# Altium project Multiplier_AD835.PrjPCB
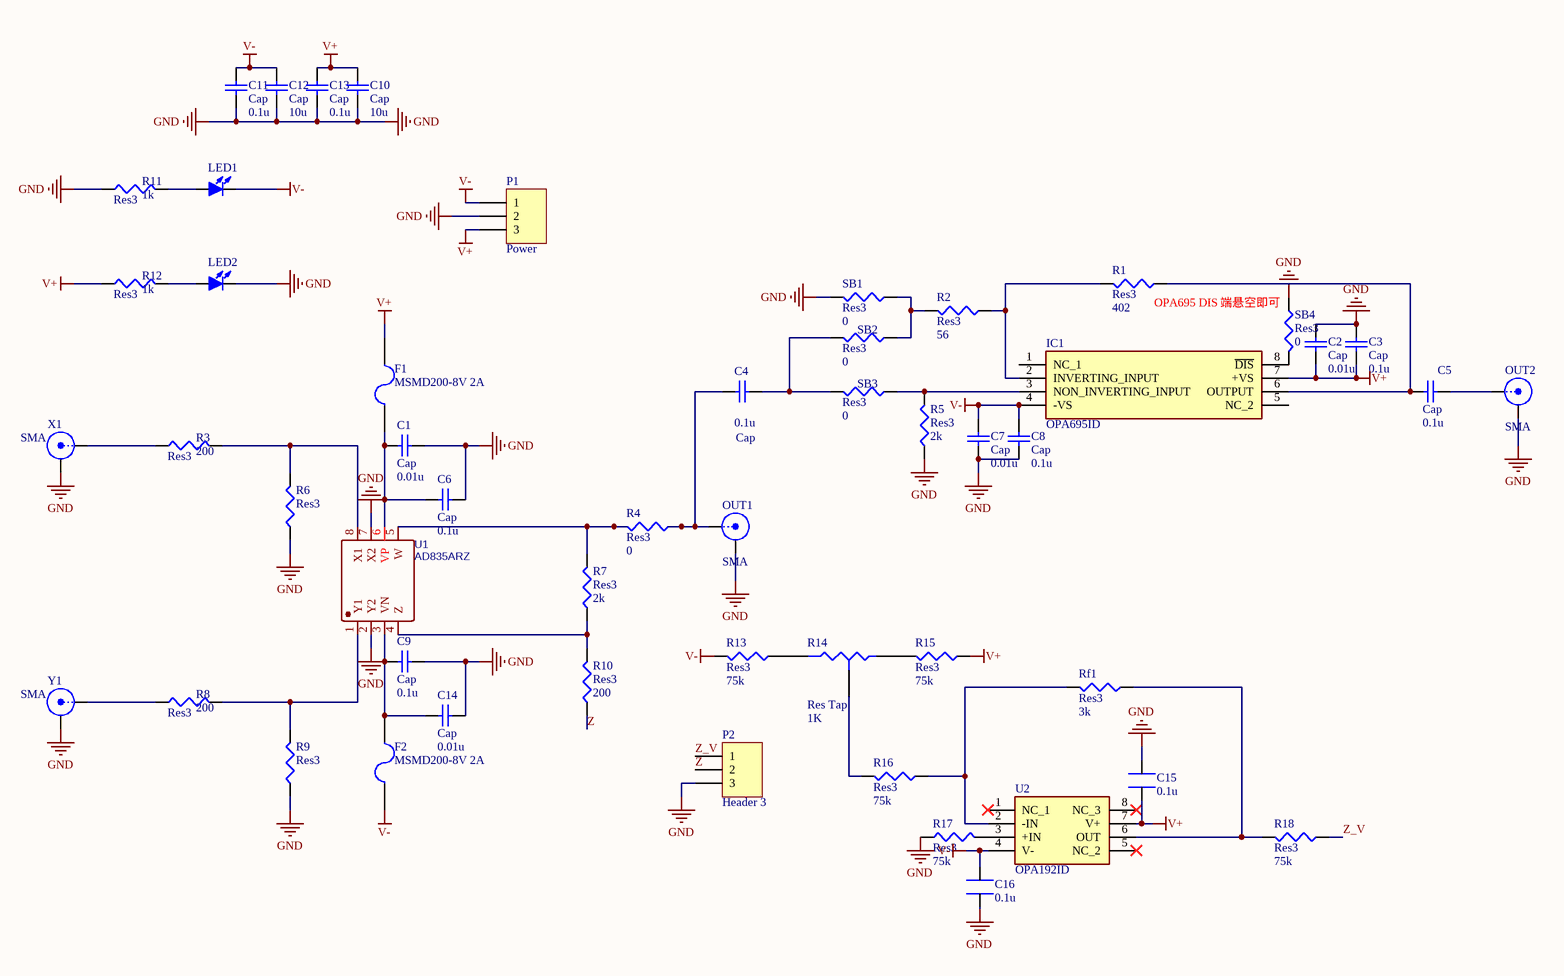
[diagram p0: Multiplier_AD835.SchDoc]
1 sheet, 52 parts. Net scope: global (net labels, ports and power ports of the same name join across sheets).
Board file: Multiplier_AD835.PcbDoc

## Sheet Multiplier_AD835.SchDoc
size A2; Organization: Altium Limited; Address1: L3, 12a Rodborough Rd; Address2: Frenchs Forest; Address3: NSW; Address4: Australia 2086

### Parts
C1  Cap  value 0.01u  [0805D]
C2  Cap  value 0.01u  [0805D]
C3  Cap  value 0.1u  [0805D]
C4  Cap  value 0.1u  [0805D]
C5  Cap  value 0.1u  [0805D]
C6  Cap  value 0.1u  [0805D]
C7  Cap  value 0.01u  [0805D]
C8  Cap  value 0.1u  [0805D]
C9  Cap  value 0.1u  [0805D]
C10  Cap  value 10u  [0805D]
C11  Cap  value 0.1u  [0805D]
C12  Cap  value 10u  [0805D]
C13  Cap  value 0.1u  [0805D]
C14  Cap  value 0.01u  [0805D]
C15  0.1u  [0805D]
C16  0.1u  [0805D]
F1  MSMD200-8V 2A  [0805D]
F2  MSMD200-8V 2A  [0805D]
IC1  OPA695ID  [SOIC127P600X175-8N]
LED1  (no value)  [0805D]
LED2  (no value)  [0805D]
OUT1  SMA  [SMA1]
OUT2  SMA  [SMA1]
P1  Power  [HDR1X3]
P2  Header 3  [HDR1X3]
R1  Res3  value 402  [0805D]
R2  Res3  value 56  [0805D]
R3  Res3  value 200  [0805D]
R4  Res3  value 0  [0805D]
R5  Res3  value 2k  [0805D]
R6  Res3  [0805D]
R7  Res3  value 2k  [0805D]
R8  Res3  value 200  [0805D]
R9  Res3  [0805D]
R10  Res3  value 200  [0805D]
R11  Res3  value 1k  [0805D]
R12  Res3  value 1k  [0805D]
R13  Res3  value 75k  [0805D]
R14  Res Tap  value 1K
R15  Res3  value 75k  [0805D]
R16  Res3  value 75k  [0805D]
R17  Res3  value 75k  [0805D]
R18  Res3  value 75k  [0805D]
Rf1  Res3  value 3k  [0805D]
SB1  Res3  value 0  [0805D]
SB2  Res3  value 0  [0805D]
SB3  Res3  value 0  [0805D]
SB4  Res3  value 0  [0805D]
U1  AD835ARZ  [AD835arz]
U2  OPA192ID  [SOIC127P600X175-8N]
X1  SMA  [SMA1]
Y1  SMA  [SMA1]

### Nets
GND: C1.1 C2.1 C3.2 C6.2 C7.2 C8.1 C9.1 C10.1 C11.1 C12.1 C13.1 C14.2 C15.1(SD) C16.1(SD) LED2.2(K) OUT1.2(Y) OUT2.2(Y) P1.2 P2.3 R5.1 R6.1 R9.1 R11.1 R17.2 SB1.2 SB4.1 U1.2(Y2) U1.7(X2) X1.2(Y) Y1.2(Y)
V+: C2.2 C3.1 C10.2 C13.2 C15.2(SD) F1.2 IC1.7(+VS) P1.3 R12.1 R15.1 U2.7(V+)
V-: C7.1 C8.2 C11.2 C12.2 C16.2(SD) F2.1 IC1.4(-VS) LED1.2(K) P1.1 R13.2 U2.4(V-)
Z: P2.2 R10.1
Z_V: P2.1 R18.1
NetC1_2: C1.2 C6.1 F1.1 U1.6(VP)
NetC4_1: C4.1 OUT1.1(X) R4.1
NetC4_2: C4.2 SB2.2 SB3.2
NetC5_1: C5.1 IC1.6(OUTPUT) R1.1
NetC5_2: C5.2 OUT2.1(X)
NetC9_2: C9.2 C14.1 F2.2 U1.3(VN)
NetIC1_2: IC1.2(INVERTING_INPUT) R1.2 R2.1
NetIC1_3: IC1.3(NON_INVERTING_INPUT) R5.2 SB3.1
NetIC1_8: IC1.8(~{DIS}) SB4.2
NetLED1_1: LED1.1(A) R11.2
NetLED2_1: LED2.1(A) R12.2
NetR2_2: R2.2 SB1.1 SB2.1
NetR3_1: R3.1 X1.1(X)
NetR3_2: R3.2 R6.2 U1.8(X1)
NetR4_2: R4.2 R7.2 U1.5(W)
NetR7_1: R7.1 R10.2 U1.4(Z)
NetR8_1: R8.1 Y1.1(X)
NetR8_2: R8.2 R9.2 U1.1(Y1)
NetR13_1: R13.1 R14.2(B)
NetR14_1: R14.1(A) R15.2
NetR14_3: R14.3(TAP) R16.2
NetR16_1: R16.1 Rf1.2 U2.2(-IN)
NetR17_1: R17.1 U2.3(+IN)
NetR18_2: R18.2 Rf1.1 U2.6(OUT)

Not connected (* = marked no-connect by the designer): IC1 1(NC_1) 5(NC_2); U2 1(NC_1)* 5(NC_2)* 8(NC_3)*

### Notes on the sheet
- (near R1) OPA695 DIS 端悬空即可
- Title
- Size:
- Date:
- File:
- A2
- Number:
- Time:
- Revision:
- Sheet
- of

### Library data of the parts
C1-C14 = Cap: Capacitor; Published: 8-Jun-2000; LatestRevisionDate: 17-Jul-2002; LatestRevisionNote: Re-released for DXP Platform.; PackageReference: RAD-0.3; Publisher: Altium Limited; PackageDescription: Radial Cap, Thru-Hole; 2 Leads; 0.3 in Pin Spacing
C15 C16 = CAP_T
F1 F2 = FU: 贴片保险丝; 版权归属: 源创客; BOM名称: 贴片保险丝; 学习资源: www.ooocke.com
IC1 = OPA695ID: Integrated Circuit; Manufacturer_Name: Texas Instruments; Datasheet Link: http://www.ti.com/lit/ds/symlink/opa695.pdf; Height: 1.75mm; Manufacturer_Part_Number: OPA695ID; Mouser Part Number: 595-OPA695ID; Mouser Price/Stock: https://www.mouser.co.uk/ProductDetail/Texas-Instruments/OPA695ID/?qs=wgAEGBTxy7n%252BTWPkkfsFRg%3D%3D; Arrow Part Number: OPA695ID; Arrow Price/Stock: https://www.arrow.com/en/products/opa695id/texas-instruments
LED1 LED2 = LED-SMD: 贴片LED; 版权归属: 源创客; BOM名称: 贴片LED; 学习资源: www.ooocke.com
OUT1 OUT2 X1 Y1 = BNC: BNC Elbow Connector; LatestRevisionDate: 17-Jul-2002; LatestRevisionNote: Re-released for DXP Platform.; Publisher: Altium Limited
P1 P2 = Header 3: Header, 3-Pin; LatestRevisionDate: 17-Jul-2002; LatestRevisionNote: Re-released for DXP Platform.; Publisher: Altium Limited
R1-R13 R15-R18 Rf1 SB1-SB4 = Res3: Resistor; Published: 8-Jun-2000; LatestRevisionDate: 29-May-2009; LatestRevisionNote: IPC-7351 Footprint Added.; PackageReference: J1-0603; Publisher: Altium Limited; PackageDescription: Chip Resistor
R14 = Res Tap: Tapped Resistor; Sim Note: Enter the Resistance value and the set point into parameter fields.; Set Position: 0.5; Published: 24-Mar-1999; LatestRevisionDate: 17-Jul-2002; LatestRevisionNote: Re-released for DXP Platform.; PackageReference: VR3; Publisher: Altium Limited; PackageDescription: Variable Resistor, Thru-Hole; 3 Leads
U1 = AD835ARZ: BOM_Manufacturer: ADI; spicePre: X; BOM_Supplier: LCSC; BOM_Manufacturer Part: AD835ARZ; BOM_Supplier Part: C26332; BOM_JLCPCB Part Class: Extended Part; spiceSymbolName: AD835ARZ
U2 = OPA192ID: Undefined or Miscellaneous; Manufacturer_Name: Texas Instruments; Datasheet Link: http://www.ti.com/lit/ds/symlink/opa192.pdf; Height: 1.75mm; Manufacturer_Part_Number: OPA192ID; Mouser Part Number: 595-OPA192ID; Mouser Price/Stock: https://www.mouser.co.uk/ProductDetail/Texas-Instruments/OPA192ID?qs=wrT8kFYR779tQjMORwdPeQ%3D%3D; Arrow Part Number: OPA192ID; Arrow Price/Stock: https://www.arrow.com/en/products/opa192id/texas-instruments?region=nac